# EAGLE design Group_9_Bastiaens_Castiaux_Danthine_Petit (EAGLE 8.1.0)
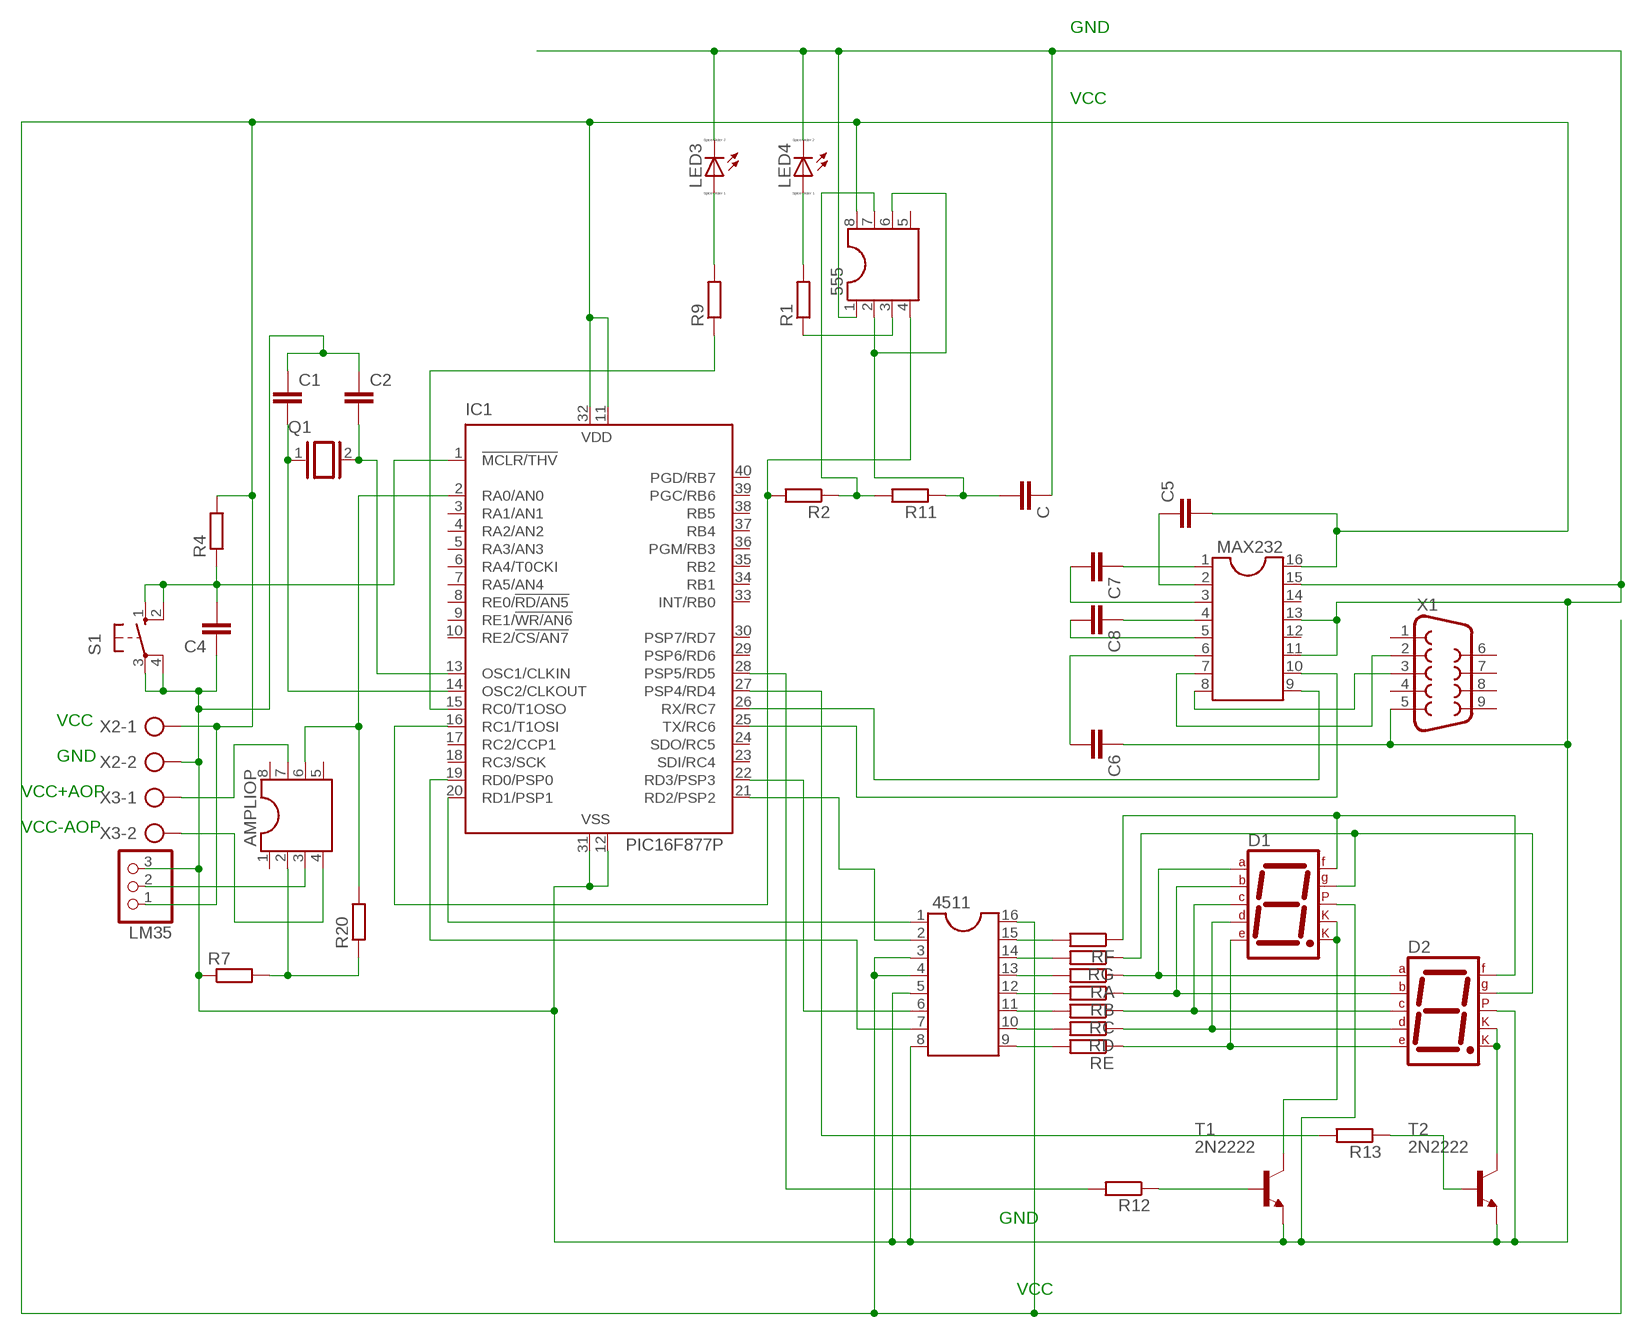
[diagram p0: schematic, sheet 1]

## Parts
555  DIL8  [DIL08]
4511  DIL16  [DIL16]
AMPLIOP  DIL8  [DIL08]
C  C-EU025-050X050  [C025-050X050]
C1  C-EU025-050X050  [C025-050X050]
C2  C-EU025-050X050  [C025-050X050]
C4  C-EU025-050X050  [C025-050X050]
C5  C-EU025-050X050  [C025-050X050]
C6  C-EU025-050X050  [C025-050X050]
C7  C-EU025-050X050  [C025-050X050]
C8  C-EU025-050X050  [C025-050X050]
D1  7SEG-CK  [7SEG-13]
D2  7SEG-CK  [7SEG-13]
IC1  PIC16F877P  [DIL40]
LED3  LED_ELD260  [LED_LD260]
LED4  LED_ELD260  [LED_LD260]
LM35  PINHD-1X3  [1X03]
MAX232  DIL16  [DIL16]
Q1  XTAL/S  [QS]
R1  R-EU_0204/7  [0204/7]
R2  R-EU_0204/7  [0204/7]
R4  R-EU_0204/7  [0204/7]
R7  R-EU_0204/7  [0204/7]
R9  R-EU_0204/7  [0204/7]
R11  R-EU_0204/7  [0204/7]
R12  R-EU_0204/7  [0204/7]
R13  R-EU_0204/7  [0204/7]
R20  R-EU_0204/7  [0204/7]
RA  R-EU_0204/7  [0204/7]
RB  R-EU_0204/7  [0204/7]
RC  R-EU_0204/7  [0204/7]
RD  R-EU_0204/7  [0204/7]
RE  R-EU_0204/7  [0204/7]
RF  R-EU_0204/7  [0204/7]
RG  R-EU_0204/7  [0204/7]
S1  10-XX  [B3F-10XX]
T1  2N2222  [TO18]
T2  2N2222  [TO18]
X1  F09V  [F09V]
X2  AK300/2  [AK300/2]
X3  AK300/2  [AK300/2]

## Nets
GND: 555.1 4511.5 4511.8 C1.1 C2.1 C4.1 C6.1 C.1 D1.5(DP) D2.5(DP) IC1.12(VSS) IC1.31(VSS) LED3.K(C) LED4.K(C) LM35.3 MAX232.11 MAX232.13 MAX232.15 R7.1 S1.3(P) S1.4(P1) T1.1(E) T2.1(E) X1.5 X2.2
N$1: IC1.27(PSP4/RD4) R13.2
N$2: C1.2 IC1.14(OSC2/CLKOUT) Q1.1
N$3: AMPLIOP.2 R7.2 R20.1
N$4: AMPLIOP.6 IC1.2(RA0/AN0) R20.2
N$5: AMPLIOP.3 LM35.2
N$6: LED4.A R1.2
N$7: C4.2 IC1.1(!MCLR/THV) R4.1 S1.1(S) S1.2(S1)
N$8: C2.2 IC1.13(OSC1/CLKIN) Q1.2
N$9: 4511.1 IC1.20(RD1/PSP1)
N$10: LED3.A R9.2
N$11: 555.3 R1.1
N$12: 555.2 555.6 C.2 R11.1
N$13: IC1.15(RC0/T1OSO) R9.1
N$14: 555.4 IC1.16(RC1/T1OSI) R2.2
N$15: MAX232.7 X1.2
N$16: MAX232.8 X1.3
N$17: C5.1 MAX232.2
N$18: C7.1 MAX232.1
N$19: C7.2 MAX232.3
N$20: C8.1 MAX232.4
N$21: C8.2 MAX232.5
N$22: C6.2 MAX232.6
N$23: IC1.25(TX/RC6) MAX232.10
N$24: IC1.26(RX/RC7) MAX232.9
N$25: 555.7 R2.1 R11.2
N$26: 4511.7 IC1.19(RD0/PSP0)
N$27: D1.3(CK1) D1.8(CK2) T1.3(C)
N$28: 4511.2 IC1.21(RD2/PSP2)
N$29: 4511.6 IC1.22(RD3/PSP3)
N$30: 4511.13 RA.2
N$31: IC1.28(PSP5/RD5) R12.2
N$32: 4511.12 RB.2
N$33: 4511.11 RC.2
N$34: 4511.10 RD.2
N$35: 4511.9 RE.2
N$36: D1.7(A) D2.7(A) RA.1
N$37: D1.2(D) D2.2(D) RD.1
N$38: D1.4(C) D2.4(C) RC.1
N$39: D1.1(E) D2.1(E) RE.1
N$41: 4511.15 RF.2
N$42: 4511.14 RG.2
N$43: AMPLIOP.7 X3.1
N$44: D1.10(G) D2.10(G) RG.1
N$45: R12.1 T1.2(B)
N$46: 555.8 4511.3 4511.4 4511.16 C5.2 IC1.11(VDD) IC1.32(VDD) LM35.1 MAX232.16 R4.2 X2.1
N$47: D2.3(CK1) D2.8(CK2) T2.3(C)
N$48: R13.1 T2.2(B)
N$49: AMPLIOP.4 X3.2
N$51: D1.6(B) D2.6(B) RB.1
N$53: D1.9(F) D2.9(F) RF.1
Unconnected: 555.5 AMPLIOP.1 AMPLIOP.5 AMPLIOP.8 IC1.3(RA1/AN1) IC1.4(RA2/AN2) IC1.5(RA3/AN3) IC1.6(RA4/T0CKI) IC1.7(RA5/AN4) IC1.8(RE0/!RD/AN5) IC1.9(RE1/!WR/AN6) IC1.10(RE2/!CS/AN7) IC1.17(RC2/CCP1) IC1.18(RC3/SCK) IC1.23(SDI/RC4) IC1.24(SDO/RC5) IC1.29(PSP6/RD6) IC1.30(PSP7/RD7) IC1.33(INT/RB0) IC1.34(RB1) IC1.35(RB2) IC1.36(PGM/RB3) IC1.37(RB4) IC1.38(RB5) IC1.39(PGC/RB6) IC1.40(PGD/RB7) MAX232.12 MAX232.14 X1.1 X1.4 X1.6 X1.7 X1.8 X1.9

## Notes on the sheet
- GND
- VCC
- VCC
- GND
- VCC+AOP
- VCC-AOP
- GND
- VCC

## Library data of the parts
555 AMPLIOP = ic-package:DIL8: Dual In Line / Socket
4511 MAX232 = ic-package:DIL16: Dual In Line / Socket
C C1 C2 C4-C8 = rcl:C-EU: CAPACITOR, European symbol
D1 D2 = special:7SEG-CK: 7-segment DISPLAY single cathode, 13 mm
IC1 = microchip:PIC16F87*: MICROCONTROLLER; MF: MICROCHIP; MPN: PIC16F877-04/P; OC_FARNELL: 9761349; OC_NEWARK: 61K3463
LED3 LED4 = eagle-ltspice:LED_E: LED Source: http://www.osram.convergy.de Source: www.luxeon.com Source: www.kingbright.com; SPICEMODEL: NONE; SPICEPREFIX: D; SPICETYPE: diode
LM35 = pinhead:PINHD-1X3: PIN HEADER
Q1 = special:XTAL/S: CRYSTAL
R1 R2 R4 R7 R9 R11-R13 R20 RA RB RC RD RE RF RG = rcl:R-EU_: RESISTOR, European symbol
S1 = switch-omron:10-XX: OMRON SWITCH; MPN: B3F-1000; OC_FARNELL: 176432; OC_NEWARK: 36M3542
T1 T2 = transistor:2N2222: NPN TRANSISTOR
X1 = con-subd:F09: SUB-D; OC_FARNELL: unknown; OC_NEWARK: unknown
X2 X3 = con-ptr500:AK300/2: CONNECTOR; OC_FARNELL: unknown; OC_NEWARK: unknown

## Board
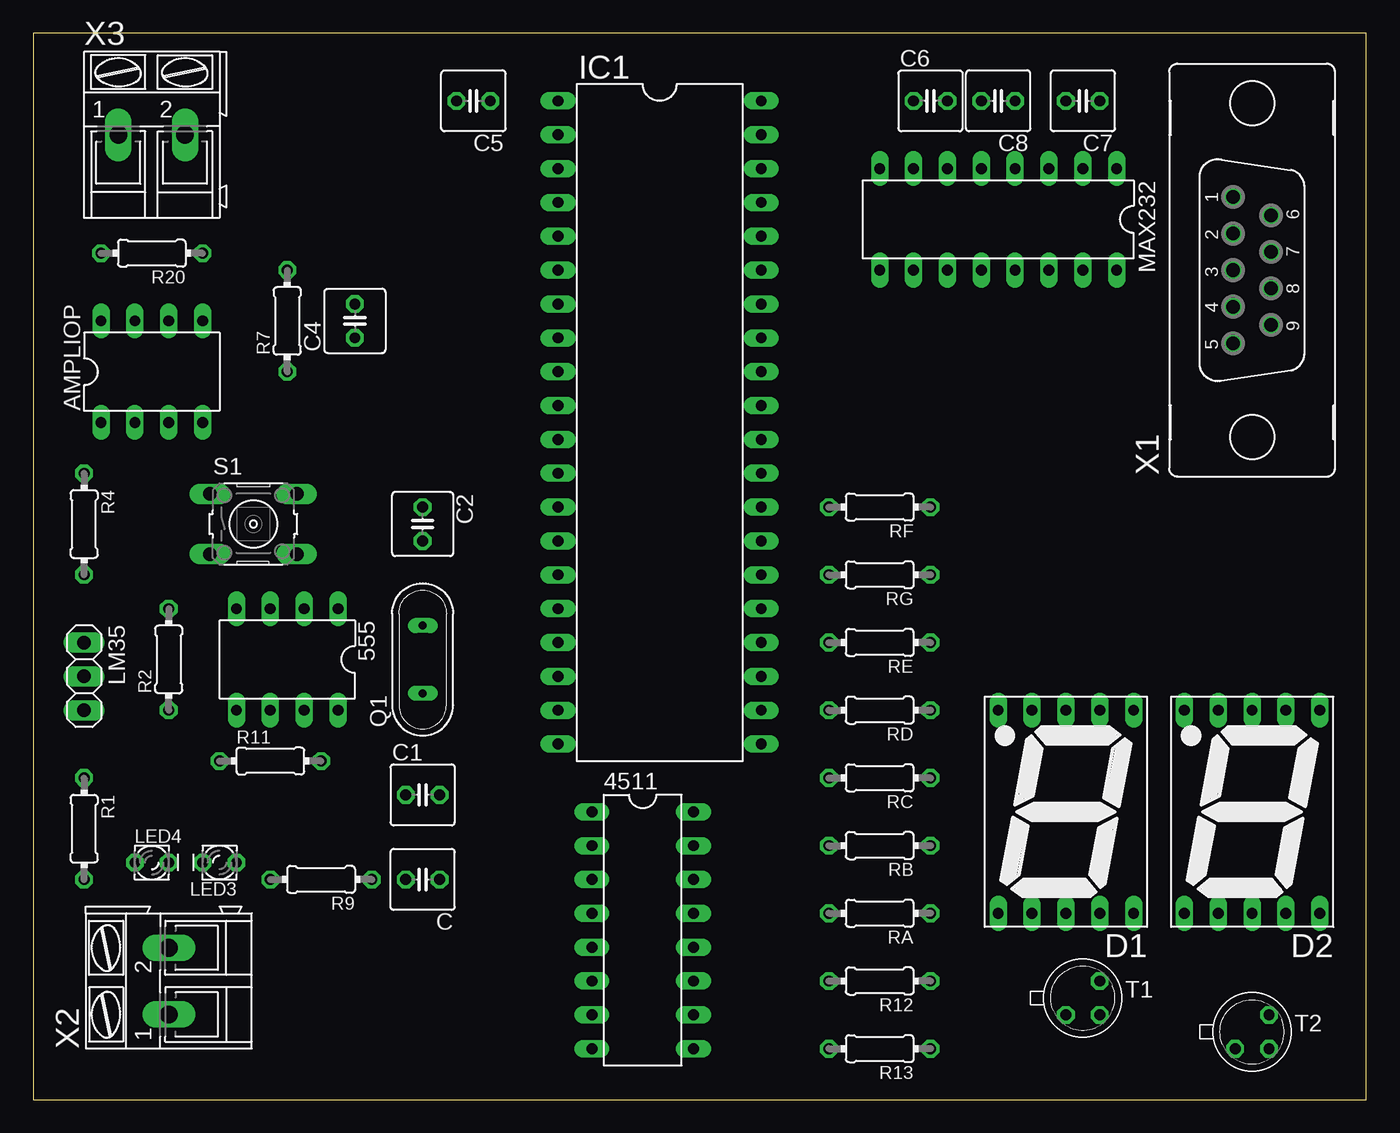
[diagram p1: board, top side]
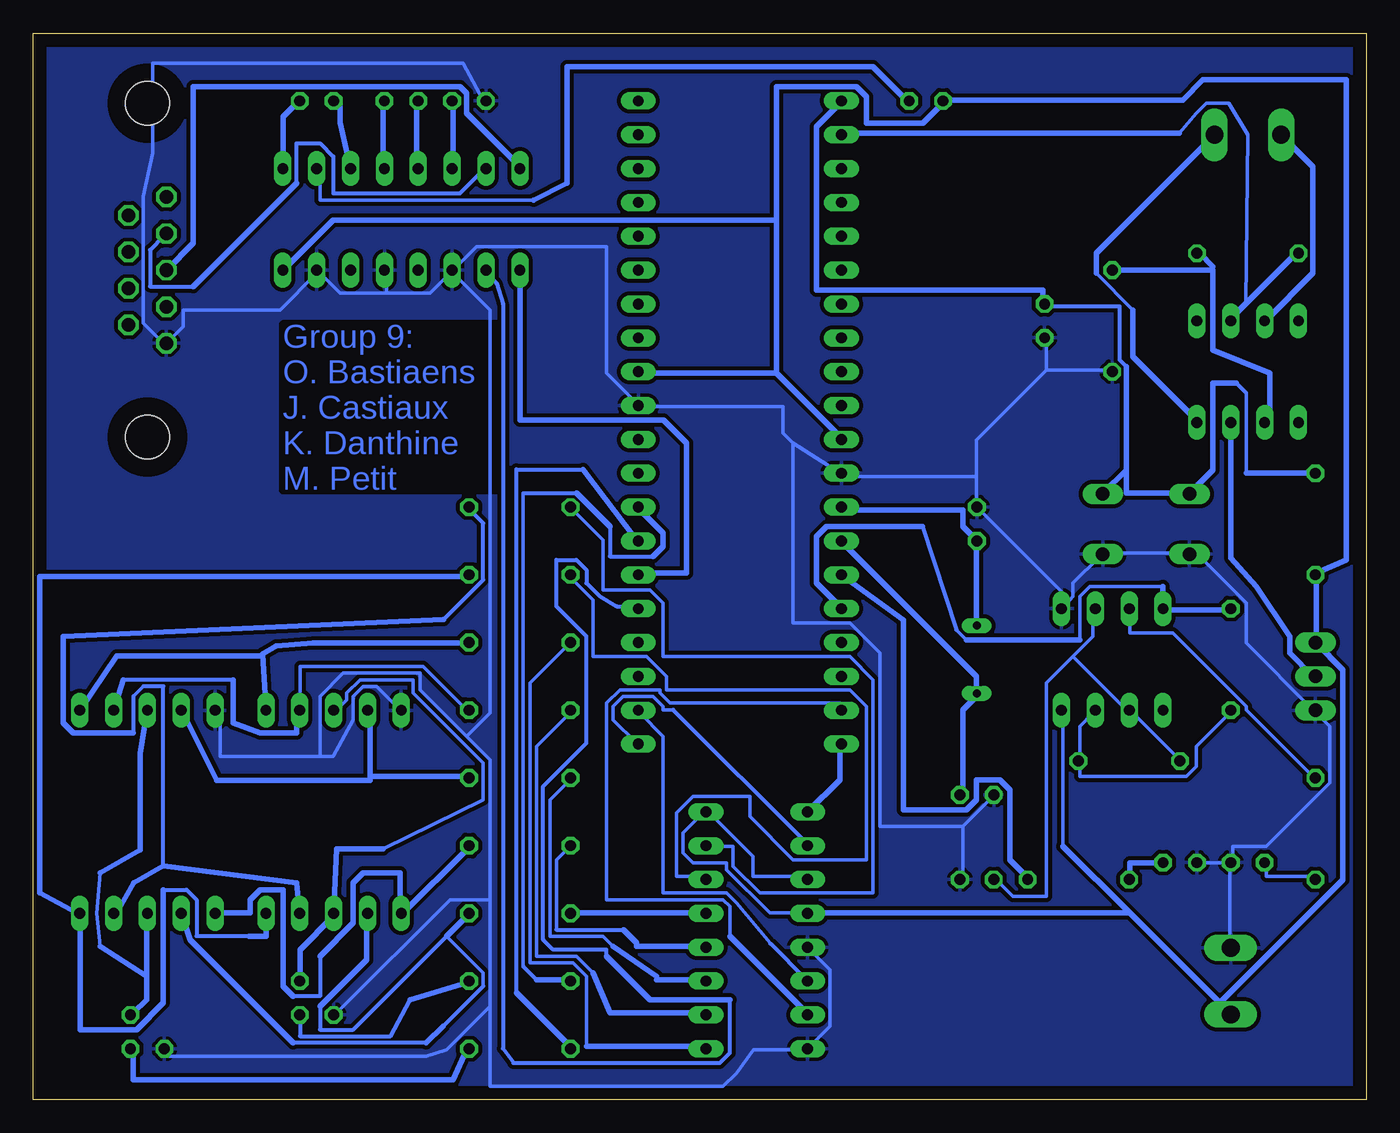
[diagram p2: board, bottom side, seen from below]

Size 100 x 80 mm. Coordinates in mm from the lower left corner, seen from the top.
Outline: 0,0 100,0 100,80 0,80 0,0
Copper layers (1*16): Top 0.035mm / dielectric 1.5mm / Bottom 0.035mm
Design rules "default": minimum track width 10mil, minimum drill 24mil, track to track 8mil, track to pad 8mil, pad to pad 8mil, via to via 8mil, smd to smd 8mil, copper to edge 40mil, drill to drill 8mil, minimum pad ring 10mil, minimum via ring 8mil, stop-mask expansion 4mil, vias tented up to drill 0mil, thermal gap 10mil

### Footprints (pad centres in the part's own frame; a part is rotated, then mirrored left to right if it is on the bottom)
DIL08 = drill 0.813 long: 1 -3.81,-3.81; 2 -1.27,-3.81; 3 1.27,-3.81; 4 3.81,-3.81; 5 3.81,3.81; 6 1.27,3.81; 7 -1.27,3.81; 8 -3.81,3.81
DIL16 = drill 0.813 long: 1 -8.89,-3.81; 2 -6.35,-3.81; 3 -3.81,-3.81; 4 -1.27,-3.81; 5 1.27,-3.81; 6 3.81,-3.81; 7 6.35,-3.81; 8 8.89,-3.81; 9 8.89,3.81; 10 6.35,3.81; 11 3.81,3.81; 12 1.27,3.81; 13 -1.27,3.81; 14 -3.81,3.81; 15 -6.35,3.81; 16 -8.89,3.81
C025-050X050 = drill 0.813 octagon: 1 -1.27,0; 2 1.27,0
7SEG-13 = drill 0.813 long: 1 -5.08,-7.62; 2 -2.54,-7.62; 3 0,-7.62; 4 2.54,-7.62; 5 5.08,-7.62; 6 5.08,7.62; 7 2.54,7.62; 8 0,7.62; 9 -2.54,7.62; 10 -5.08,7.62
DIL40 = drill 0.813 long: 1 -24.13,-7.62; 2 -21.59,-7.62; 3 -19.05,-7.62; 4 -16.51,-7.62; 5 -13.97,-7.62; 6 -11.43,-7.62; 7 -8.89,-7.62; 8 -6.35,-7.62; 9 -3.81,-7.62; 10 -1.27,-7.62; 11 1.27,-7.62; 12 3.81,-7.62; 13 6.35,-7.62; 14 8.89,-7.62; 15 11.43,-7.62; 16 13.97,-7.62; 17 16.51,-7.62; 18 19.05,-7.62; 19 21.59,-7.62; 20 24.13,-7.62; 21 24.13,7.62; 22 21.59,7.62; 23 19.05,7.62; 24 16.51,7.62; 25 13.97,7.62; 26 11.43,7.62; 27 8.89,7.62; 28 6.35,7.62; 29 3.81,7.62; 30 1.27,7.62; 31 -1.27,7.62; 32 -3.81,7.62; 33 -6.35,7.62; 34 -8.89,7.62; 35 -11.43,7.62; 36 -13.97,7.62; 37 -16.51,7.62; 38 -19.05,7.62; 39 -21.59,7.62; 40 -24.13,7.62
LED_LD260 = drill 0.813 octagon: A -1.27,0; K 1.27,0
1X03 = drill 1.016 long: 1 -2.54,0; 2 0,0; 3 2.54,0
QS = drill 0.61 long: 1 -2.54,0; 2 2.54,0
0204/7 = drill 0.813 octagon: 1 -3.81,0; 2 3.81,0
B3F-10XX = drill 1.016 long: 1 -3.251,2.261; 2 3.251,2.261; 3 -3.251,-2.261; 4 3.251,-2.261
TO18 = drill 0.813 octagon: 1 -1.27,-1.27; 2 1.27,-1.27; 3 1.27,1.27
F09V = drill 1.016 octagon: 1 5.486,1.422; 2 2.743,1.422; 3 0,1.422; 4 -2.743,1.422; 5 -5.486,1.422; 6 4.115,-1.422; 7 1.372,-1.422; 8 -1.372,-1.422; 9 -4.115,-1.422 | hole 3.302: -12.522,0; 12.522,0
AK300/2 = drill 1.321 long: 1 -2.515,0; 2 2.489,0

### Placement (x,y rotation side)
555  19.05,33.02 180 top
4511  45.72,12.7 270 top
AMPLIOP  8.89,54.61 0 top
C  29.21,16.51 180 top
C1  29.21,22.86 0 top
C2  29.21,43.18 270 top
C4  24.13,58.42 90 top
C5  33.02,74.93 180 top
C6  67.31,74.93 0 top
C7  78.74,74.93 180 top
C8  72.39,74.93 180 top
D1  77.47,21.59 180 top
D2  91.44,21.59 180 top
IC1  46.99,50.8 270 top
LED3  13.97,17.78 180 top
LED4  8.89,17.78 0 top
LM35  3.81,31.75 270 top
MAX232  72.39,66.04 180 top
Q1  29.21,33.02 90 top
R1  3.81,20.32 270 top
R2  10.16,33.02 90 top
R4  3.81,43.18 270 top
R7  19.05,58.42 90 top
R9  21.59,16.51 180 top
R11  17.78,25.4 0 top
R12  63.5,8.89 180 top
R13  63.5,3.81 180 top
R20  8.89,63.5 180 top
RA  63.5,13.97 180 top
RB  63.5,19.05 180 top
RC  63.5,24.13 180 top
RD  63.5,29.21 180 top
RE  63.5,34.29 180 top
RF  63.5,44.45 180 top
RG  63.5,39.37 180 top
S1  16.51,43.18 0 top
T1  78.74,7.62 0 top
T2  91.44,5.08 0 top
X1  91.44,62.23 90 top
X2  10.16,8.89 90 top
X3  8.89,72.39 0 top

### Tracks (layer width: path | path; a pad name or v marks a point on that pad's centre or on a via)
GND
  Bottom 0.254: 78.5,25.73 86,25.73 86,28.75 86.25,29 D2.5 | 78.5,25.73 77.5,25.73 76,28.5 76,30.25 75.25,31 74.25,31 72.5,29.25 D1.5 | 4511.5 41.75,11.25 40.25,9.75 40.25,5.5 41.75,4 4511.8 42,3.75 45.98,3.75 47.25,1.98 48.25,0.98 65.75,0.98 65.75,7 | 65.75,15 68.75,15 77.25,6.5 T1.1 | 65.75,7 65.75,15 | 65.75,7 69,3.75 70.52,3.25 90,3.25 90,3.75 T2.1 | 78.5,25.73 78.5,30.25 76.75,32 71,32 71,30.75 67.5,27.25 | 67.5,27.25 65.75,25.5 65.75,15 | 73.5,60.5 70.25,60.5 68.75,62 MAX232.11 | 73.5,60.5 73.5,62 MAX232.13 | 73.5,60.5 77,60.5 78.5,62 MAX232.15 78.75,62 81.5,59.25 88.75,59.25 88.75,58 90,56.75 X1.5 90.25,56.75 91.75,58.25 91.75,67.75 91.04,71 91.04,77.77 67.75,77.77 66.25,75 C6.1 | 10.25,17.75 12.5,17.75 LED3.K | 10.25,17.75 10.25,11.5 X2.2 | 10.25,17.75 LED4.K 10,18 10,19 7.5,19 2.75,23.75 2.75,28 3.75,29 LM35.3 4,29.25 9,34.25 9,37.25 12.5,40.75 13.25,40.75 S1.3 13.5,41 19.75,41 S1.4 20,40.75 22,38.75 22,37.75 22.25,37.5 | 30.25,20.5 28,22.75 C1.1 | 30.25,20.5 30.25,16.75 C.1 | 24,54.75 19.25,54.75 R7.1 | 24,54.75 24,57 C4.1 | 22.25,37.5 22.75,37 555.1 22.25,37.5 | 22.25,37.5 29,44.25 C2.1 29.25,44.5 29.25,46.75 | 29.25,46.75 39.25,46.75 IC1.12 39.5,47 43.02,49.25 | 43.02,49.25 43.77,50 43.77,52 54.5,52 IC1.31 54.75,52.25 57,54.5 57,64 66.75,64 68.5,62.25 MAX232.11 | 24,54.75 29.25,49.5 29.25,46.75 | 30.25,20.5 36.5,20.5 36.5,33.5 38.75,35.75 43.02,35.75 43.02,49.25 | 67.5,27.25 65.75,29 65.75,59.25 68.5,62 MAX232.11
  pour Bottom (isolate 0.305): 0,80.01 100.33,80.01 100.33,-1.27 0,-1.27 0,1.27
N$1
  Bottom 0.254: 54.75,42 IC1.27 | 59.75,4 R13.2
  Bottom 0.305: 58.75,47.27 63.75,47.27 63.75,8
  Bottom 0.406: 58.75,47.27 54.75,42 | 59.75,4 63.75,8
N$2
  Bottom 0.254: 29.25,30.25 Q1.1 29.25,30.5 | 39.25,41.75 IC1.14
  Bottom 0.406: 29.25,30.25 30.25,29.25 30.25,23 C1.2 | 39.25,41.75 29.25,31.75 29.25,30.5
N$3
  Bottom 0.254: 11.5,62.5 11.5,62.25 | 12.5,63.5 R20.1 | 19,62.25 R7.2
  Bottom 0.406: 12.5,63.5 11.5,62.5 | 19,62.25 11.5,62.25 11.5,56.23 7.23,54.5 7.23,50.8 AMPLIOP.2
N$4
  Bottom 0.254: 10,58.75 10,58.5 AMPLIOP.6 | 5.25,63.5 R20.2 | 14.02,72.5 12.75,74 12,74.75 10.29,74.75 8.89,72.39 9.02,59.73 | 39.25,72.5 IC1.2
  Bottom 0.406: 10,58.75 9.02,59.73 5.25,63.5 | 14.02,72.5 39.25,72.5
N$5
  Bottom 0.254: 4,31.75 LM35.2
  Bottom 0.406: 4,31.75 5.75,33.5 5.75,34.75 8.23,38.5 10.16,40.64 10.16,50.25 AMPLIOP.3
N$6
  Bottom 0.254: R1.2 4,16.75 7.5,16.75 7.5,17.75 LED4.A
N$7
  Bottom 0.254: 9,53.02 9,47 | 4,47 R4.1 | 13.25,45.5 S1.1 13.5,45.5 | 24,59.5 C4.2 24.25,59.75 | 19.75,45.5 S1.2 | 39.5,74.75 IC1.1
  Bottom 0.305: 9.75,53.77 9,53.02 | 24,59.5 18.5,59.5 18.5,55.5 18,55
  Bottom 0.406: 9,47 4,47 | 9.75,53.77 11.5,53.77 11.5,47.25 13.25,45.5 | 18,47.25 18,55 | 19.75,45.5 18,47.25 | 39.5,74.75 41.25,73 41.25,60.73 40,60.75 24.25,60.75 24.25,59.75 | 13.5,45.5 18,45.5 18,47.25
N$8
  Bottom 0.254: 29.25,35.75 Q1.2 | 29.25,41.75 C2.2 29.25,42
  Bottom 0.406: 29.25,41.75 29.25,35.75 | 29.25,42 30.25,43 30.25,44.25 39.25,44.25 IC1.13
N$9
  Bottom 0.406: 4511.1 39.5,24 39.5,26.5 IC1.20
N$10
  Bottom 0.254: 15.25,17.75 LED3.A | 17.75,16.75 R9.2
  Bottom 0.406: 15.25,17.75 17.75,17.75 17.75,16.75
N$11
  Bottom 0.254: R1.1 4,24.25 9,29.25 9,29.5 14.5,35 17.75,35 17.75,36.75 555.3
N$12
  Bottom 0.254: R11.1 14,25.5 17.75,29.25 555.6 18,29.25 22,33.25 | 22,33.25 20.5,34.75 20.5,36.75 555.2 | 22,33.25 24,31.25 24,15.25 26.5,15.25 27.75,16.5 C.2
N$13
  Bottom 0.406: IC1.15 34.73,36 34.73,21.75 30,21.75 29.25,22.5 29.25,24 27.5,24 26.75,23.25 26.75,18 25.5,16.75 R9.1
N$14
  Bottom 0.254: 10.25,36.75 R2.2 | 30.75,35.25 30,34.5 | 21.5,34.5 21.5,37.75 20.75,38.5 15.25,38.5 | 39.5,37 IC1.16 | 15.25,37 555.4
  Bottom 0.305: 33.29,43 30.75,35.25
  Bottom 0.406: 10.25,36.75 15,36.75 555.4 | 39.5,37 41.25,38.75 41.25,42.25 40.5,43 33.29,43 | 21.5,34.5 30,34.5 | 15.25,37 15.25,38.5
N$15
  Bottom 0.305: 80.25,68.75 80.25,71.75 78.5,71.75 77.5,70.75 77.5,68 68,68 66.25,69.75 MAX232.7 | 88,61 91.25,61 91.25,63.75 90.25,64.75 X1.2
  Bottom 0.406: 88,61 80.25,68.75
N$16
  Bottom 0.254: 90,62.25 X1.3
  Bottom 0.406: 90,62.25 88,64.25 88,76 68,76 67.5,75.5 67.5,74 63.5,70 MAX232.8
N$17
  Bottom 0.254: 62.48,67.5 78.5,67.5 78.5,69.75 MAX232.2
  Bottom 0.406: 62.48,67.5 59.96,68.75 59.96,77.5 37,77.5 34.5,75 C5.1
N$18
  Bottom 0.406: C7.1 80.25,74.75 81.25,73.75 81.25,70 MAX232.1
N$19
  Bottom 0.254: 76.25,70 MAX232.3
  Bottom 0.406: 76.25,70 77,73.29 77,74.5 77.25,74.75 C7.2
N$20
  Bottom 0.406: MAX232.4 73.75,70 73.75,74.75 C8.1
N$21
  Bottom 0.406: MAX232.5 71.25,70 71.25,74.75 C8.2
N$22
  Bottom 0.406: MAX232.6 68.5,70 68.5,74.75 C6.2
N$23
  Bottom 0.305: 57,10.75 57,11.25 61,11.25 61.75,12 61.75,23.5 58.5,26.75 58.5,34.75 60.75,37 60.75,40.5 59.25,40.5 58.5,39.75 58.5,38.75 57.5,37.75 56.23,37 54.75,37 IC1.25 | 47.75,7.5 47.75,3.5 48.5,2.75 63.98,2.75 64.77,3.81 64.77,59.69 65.25,61.25 66,62 MAX232.10
  Bottom 0.406: 57,10.75 53.75,7.5 47.75,7.5
N$24
  Bottom 0.254: 54.5,39.5 IC1.26
  Bottom 0.406: 54.5,39.5 50.98,39.5 50.98,49.25 52.73,51 63.5,51 MAX232.9
N$25
  Bottom 0.254: R2.1 10.25,29 12.75,26.5 12.75,25 13.5,24.25 21.5,24.25 21.5,25.25 R11.2 21.5,25.5 21.5,28 20.5,29 555.7
N$26
  Bottom 0.254: 47.75,12.25 47.75,14.5 48.25,15 57,15 57,29.75 56,30.75 53,30.75 53,30.5 52.25,29.75 39.5,29.75 39.5,29.25 IC1.19 | 42,6.5 4511.7
  Bottom 0.406: 47.75,12.25 42,6.5
N$27
  Bottom 0.254: 80,9 T1.3 | 73.75,18.79 66.25,22.48 66.25,25.25 71.5,30.5 71.5,31.5 75.5,31.5 76.5,30.5 76.5,30 77.25,29.25 D1.3
  Bottom 0.406: 80,9 80,11.25 77.5,13.75 D1.8 77.25,18.79 73.75,18.79
N$28
  Bottom 0.254: 52,29.25 52.75,29.25 52.75,29.5 53.5,30.25 55.75,30.25 56.5,29.5 56.5,28.5 54.75,26.75 IC1.21
  Bottom 0.305: 52,29.25 42,19.25
  Bottom 0.406: 42,19.25 4511.2
N$29
  Bottom 0.254: 44.71,11.71 47.25,14.75 48,15.5 52.75,15.5 52.75,27.25 54.5,29 IC1.22 | 42,9 4511.6
  Bottom 0.305: 44.71,11.71 42,9
N$30
  Bottom 0.254: 49.75,14 4511.13 | 59.5,14 RA.2
  Bottom 0.406: 59.5,14 49.75,14
N$31
  Bottom 0.254: 63.25,10 63.25,45.5 | 54.5,44.25 IC1.28 | 59.75,9 R12.2
  Bottom 0.305: 53.5,40.75 56.75,40.75 56.75,43 | 63.25,45.5 59.25,45.5 | 62.25,9 63.25,10
  Bottom 0.406: 54.5,44.25 52.75,42.5 52.75,41.5 53.5,40.75 | 59.25,45.5 56.75,43 | 59.75,9 62.25,9
N$32
  Bottom 0.254: 60.75,12.75 60.75,18 59.75,19 RB.2 | 49.75,11.5 4511.12
  Bottom 0.305: 60.75,12.75 55.73,12.75
  Bottom 0.406: 49.75,11.5 54.73,11.5 54.73,11.75 55.73,12.75
N$33
  Bottom 0.254: 53.23,9.25 53.23,9 | 56.5,11.5 57.25,12.25 61.25,12.25 61.25,22.5 59.75,24 RC.2 | 49.75,9 4511.11
  Bottom 0.406: 53.23,9 49.75,9 | 56.5,11.5 53.23,9.25
N$34
  Bottom 0.254: 58,9.5 59.25,10.75 62.25,10.75 62.25,26.5 59.75,29 RD.2 | 49.75,6.5 4511.10
  Bottom 0.406: 49.75,6.5 56.73,6.5 58,9.5
N$35
  Bottom 0.254: 58.5,4 58.5,9.25 59.5,10.25 62.75,10.25 62.75,31.25 59.75,34.25 RE.2 | 49.75,4 4511.9
  Bottom 0.406: 58.5,4 49.75,4
N$36
  Bottom 0.254: 67.5,13.75 RA.1 | 66.25,8.5 66.25,9.5 69,12.25
  Bottom 0.305: 69,12.25 76,5.25 78.5,5.25 78.5,7 | 70.52,4.25 80.5,4.25 | 66.25,8.5 69.25,5.5
  Bottom 0.406: 69,12.25 67.5,13.75 | 78.5,7 75,10.5 75,13.75 D1.7 | 80.5,4.25 88.25,12 D2.7 | 69.25,5.5 70.52,4.25
N$37
  Bottom 0.254: RD.1 67.5,29.25 70.75,32.5 80,32.5 80,29.25 D1.2
  Bottom 0.305: 85.02,31.5 93.27,31.5
  Bottom 0.406: 85.02,31.5 85.02,28.25 83,27.5 80.25,27.5 80.25,29 D1.2 | 93.27,31.5 D2.2
N$38
  Bottom 0.254: 88.75,29 D2.4
  Bottom 0.406: 74.75,24.25 67.5,24.25 RC.1 | 74.75,24.25 74.75,29 D1.4 | 74.75,24.25 74.75,23.96 86.25,23.96 88.75,29
N$39
  Bottom 0.254: 82.79,33.42 83.04,33.27 | 96.5,29.25 D2.1
  Bottom 0.406: RE.1 67.5,34.25 79,34.25 81.77,34.02 82.79,33.42 D1.1 | 96.5,29.25 93.75,33.27 83.04,33.27
N$41
  Bottom 0.254: 4511.15 49.5,19 47.5,19 47.5,17.5 45.5,15.5 37,15.5 37,31.5 38.75,33.25 52.75,33.25 52.75,37.25 53.75,38.25 57.25,38.25 57.25,42 59.5,44.25 RF.2
N$42
  Bottom 0.254: 4511.14 49.75,16.75 51.75,16.75 51.75,21.5 50.5,22.75 46.25,22.75 46.25,21.25 43,18 37.5,18 37.5,29.5 38.75,30.75 52.5,30.75 52.5,31.75 54,33.25 58,33.25 58,37.5 59.5,39 59.5,39.25 RG.2
N$43
  Bottom 0.254: 7.5,58.5 AMPLIOP.7 | 6.25,72.25 X3.1
  Bottom 0.406: 7.5,58.5 4,62 4,70 6.25,72.25
N$44
  Bottom 0.254: 83.82,12.25 83.48,12.25 | 96.5,13.75 D2.10 96.75,14 | 67.5,39.25 RG.1
  Bottom 0.305: 83.82,12.25 87.75,12.25 87.75,15 88.5,15.75 90.25,15.75
  Bottom 0.406: 90.25,15.75 90.25,7.25 92.25,5.25 96.5,5.25 96.5,13.75 | 67.5,39.25 99.52,39.25 99.52,15.5 96.75,14 | D1.10 82.55,12.25 83.82,12.25
N$45
  Bottom 0.305: 71.75,7.48 73.21,4.75 80,4.75 80,6.25 T1.2
  Bottom 0.406: 71.75,7.48 67.5,8.75 R12.1
N$46
  Bottom 0.254: 39.5,49.75 IC1.11 | 54.5,54.5 IC1.32 | 31.75,74.75 C5.2 31.75,75 | 81.25,62.25 MAX232.16 | 4511.3 42,16.75 46,16.75 46,18.25 49.5,21.75 4511.16 49.75,21.5 51.25,20 51.25,18.5 50.5,17.75 48,17.75 48,17.25 44.75,14 42,14 4511.4 41.75,14 | 3.75,39.25 R4.2 3.75,39.5 | 3.75,34.5 LM35.1 3.75,34.25 | 22.75,19 22.75,29 555.8 | 11,7.25 10.25,6.5 X2.1
  Bottom 0.406: 44.25,54.5 39.5,49.75 | 54.5,54.5 44.25,54.5 | 31.75,74.75 33.25,73.25 37.5,73.25 37.5,75.25 38.25,76 44.25,76 44.25,66 | 44.25,54.5 44.25,66 | 81.25,62.25 77.5,66 44.25,66 | 3.75,34.5 3.75,39.25 | 11,7.25 17.75,14 | 17.75,14 22.75,19 | 17.75,14 41.75,14 | 3.75,34.25 1.75,32.25 1.75,16.5 11,7.25 | 11,7.25 X2.1 | 31.75,75 13.77,75 12.25,76.52 1.48,76.52 1.48,40.5 3.75,39.5
N$47
  Bottom 0.254: 92.5,6.5 T2.3 | 91.5,13.75 D2.8 | 95,11.48 95.25,13.97 95,17.02
  Bottom 0.406: 92.5,6.5 91.5,7.5 91.5,9.25 | 91.5,13.75 91.5,9.25 | 95,17.02 92,18.75 92,25.96 91.5,29 D2.3 | 91.5,9.25 95,11.48
N$48
  Bottom 0.254: 92.5,3.75 T2.2
  Bottom 0.406: 92.5,3.75 92.5,1.48 68.5,1.48 67.5,3.75 R13.1
N$49
  Bottom 0.254: 20.25,62 17.5,59.25 | 12.75,51 AMPLIOP.4 | 11.5,72.25 X3.2
  Bottom 0.406: 12.75,51 17.5,55.75 17.5,59.25 | 20.25,62 20.25,63.5 11.5,72.25
N$51
  Bottom 0.254: 67.5,18.75 67.5,19 RB.1 | 86.25,14 D2.6
  Bottom 0.305: 80.5,7.75 78.5,7.75 78.5,10.75
  Bottom 0.406: 67.5,18.75 72.25,14 D1.6 72.5,14 72.5,17.02 75.25,17.02 76,16.27 76,13.25 78.5,10.75 | 86.25,14 83.75,14 83.75,15 83,15.75 81.25,15.75 81.25,8.5 80.5,7.75
N$53
  Bottom 0.254: 93.75,14 D2.9 | 91.75,31 92.5,30.25 | 67.25,44.25 RF.1
  Bottom 0.305: 67.25,44.25 66.25,43.25 66.25,39 69.23,36.02 | 92.5,30.25 92.5,27.5 | 91.75,31 90.25,31 90.25,17.52
  Bottom 0.406: 93.75,14 92.48,16.25 90.25,17.52 80.23,16.25 D1.9 | 69.23,36.02 97.75,34.75 97.75,28.25 97,27.5 92.5,27.5

### Text on the board
Bottom: Group 9: / O. Bastiaens / J. Castiaux / K. Danthine / M. Petit